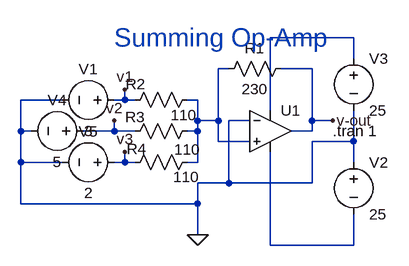
[diagram p0: schematic 3.Summing Amplifier.asc]
3.Summing Amplifier.asc, the LTspice schematic file:
Version 4.1
SHEET 1 880 3060
WIRE -3056 2736 -3184 2736
WIRE -3056 2768 -3056 2736
WIRE -3248 2784 -3264 2784
WIRE -3120 2784 -3168 2784
WIRE -3504 2832 -3568 2832
WIRE -3408 2832 -3408 2816
WIRE -3408 2832 -3424 2832
WIRE -3392 2832 -3408 2832
WIRE -3296 2832 -3312 2832
WIRE -3184 2848 -3184 2736
WIRE -3296 2864 -3296 2832
WIRE -3264 2864 -3264 2784
WIRE -3264 2864 -3296 2864
WIRE -3216 2864 -3248 2864
WIRE -3120 2864 -3120 2784
WIRE -3088 2864 -3120 2864
WIRE -3568 2880 -3568 2832
WIRE -3552 2880 -3568 2880
WIRE -3424 2880 -3424 2864
WIRE -3424 2880 -3472 2880
WIRE -3392 2880 -3424 2880
WIRE -3296 2880 -3296 2864
WIRE -3296 2880 -3312 2880
WIRE -3120 2880 -3120 2864
WIRE -3120 2880 -3152 2880
WIRE -3264 2896 -3264 2864
WIRE -3216 2896 -3264 2896
WIRE -3056 2896 -3056 2848
WIRE -3056 2896 -3120 2896
WIRE -3568 2928 -3568 2880
WIRE -3504 2928 -3568 2928
WIRE -3408 2928 -3408 2912
WIRE -3408 2928 -3424 2928
WIRE -3392 2928 -3408 2928
WIRE -3296 2928 -3296 2880
WIRE -3296 2928 -3312 2928
WIRE -3056 2928 -3056 2896
WIRE -3248 2960 -3248 2864
WIRE -3248 2960 -3296 2960
WIRE -3120 2960 -3120 2896
WIRE -3120 2960 -3248 2960
WIRE -3568 2992 -3568 2928
WIRE -3296 2992 -3296 2960
WIRE -3296 2992 -3568 2992
WIRE -3296 3040 -3296 2992
WIRE -3184 3056 -3184 2912
WIRE -3056 3056 -3056 3008
WIRE -3056 3056 -3184 3056
FLAG -3296 3040 0
FLAG -3088 2864 v-out
FLAG -3408 2816 v1
FLAG -3424 2864 v2
FLAG -3408 2912 v3
SYMBOL OpAmps\\UniversalOpAmp2 -3184 2880 R0
SYMATTR InstName U1
SYMBOL res -3152 2768 R90
WINDOW 0 0 56 VBottom 2
WINDOW 3 32 56 VTop 2
SYMATTR InstName R1
SYMATTR Value 230
SYMATTR SpiceLine tol=1 pwr=0.1
SYMBOL voltage -3056 2912 R0
WINDOW 123 0 0 Left 0
WINDOW 39 0 0 Left 0
SYMATTR InstName V2
SYMATTR Value 25
SYMBOL voltage -3056 2752 R0
WINDOW 123 0 0 Left 0
WINDOW 39 0 0 Left 0
SYMATTR InstName V3
SYMATTR Value 25
SYMBOL res -3296 2816 R90
WINDOW 0 7 95 VBottom 2
WINDOW 3 24 21 VTop 2
SYMATTR InstName R2
SYMATTR Value 110
SYMATTR SpiceLine tol=1 pwr=0.1
SYMBOL res -3296 2864 R90
WINDOW 0 10 96 VBottom 2
WINDOW 3 29 16 VTop 2
SYMATTR InstName R3
SYMATTR Value 110
SYMATTR SpiceLine tol=1 pwr=0.1
SYMBOL res -3296 2912 R90
WINDOW 0 11 94 VBottom 2
WINDOW 3 23 17 VTop 2
SYMATTR InstName R4
SYMATTR Value 110
SYMATTR SpiceLine tol=1 pwr=0.1
SYMBOL voltage -3408 2832 R90
WINDOW 0 -32 56 VBottom 2
WINDOW 3 32 56 VTop 2
WINDOW 123 0 0 Left 0
WINDOW 39 0 0 Left 0
SYMATTR InstName V1
SYMATTR Value 3
SYMBOL voltage -3456 2880 R90
WINDOW 0 -32 56 VBottom 2
WINDOW 3 32 56 VTop 2
WINDOW 123 0 0 Left 0
WINDOW 39 0 0 Left 0
SYMATTR InstName V4
SYMATTR Value 5
SYMBOL voltage -3408 2928 R90
WINDOW 0 -32 56 VBottom 2
WINDOW 3 32 56 VTop 2
WINDOW 123 0 0 Left 0
WINDOW 39 0 0 Left 0
SYMATTR InstName V5
SYMATTR Value 2
TEXT -3088 2880 Left 2 !.tran 1
TEXT -3424 2736 Left 4 ;Summing Op-Amp

The netlist it stands for:
* 3.Summing Amplifier.asc
X§U1 N002 0 N001 N003 v-out level2 Avol=1Meg GBW=10Meg Slew=10Meg Ilimit=25m Rail=0 Vos=0 En=0 Enk=0 In=0 Ink=0 Rin=500Meg  ; pins In+ In- V+ V- OUT
R1 v-out N002 230 tol=1 pwr=0.1
V2 0 N003 25
V3 N001 0 25
R2 N002 v1 110 tol=1 pwr=0.1
R3 N002 v2 110 tol=1 pwr=0.1
R4 N002 v3 110 tol=1 pwr=0.1
V1 v1 0 3
V4 v2 0 5
V5 v3 0 2
.tran 1
* Summing Op-Amp
.lib UniversalOpAmp2.lib
.backanno
.end